# EAGLE design signalamp (EAGLE 9.6.2)
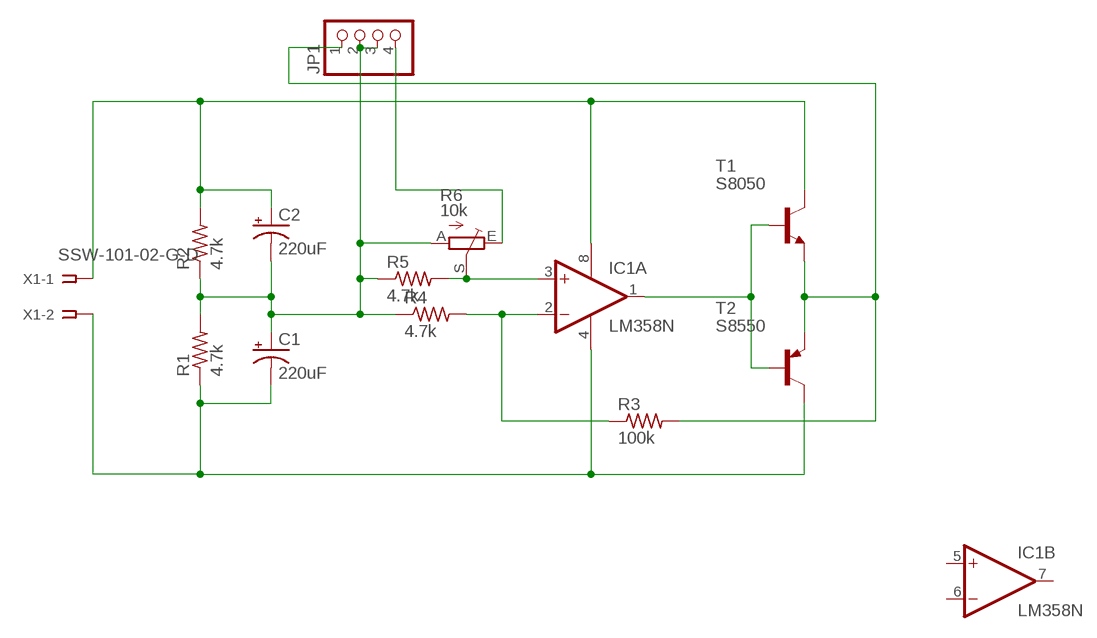
[diagram p0: schematic, sheet 1]

## Parts
C1  220uF  CPOL-USE2-5  [E2-5]
C2  220uF  CPOL-USE2-5  [E2-5]
IC1  LM358N  [DIL08]
JP1  PINHD-1X4  [1X04]
R1  4.7k  R-US_0204/7  [0204/7]
R2  4.7k  R-US_0204/7  [0204/7]
R3  100k  R-US_0207/5V  [0207/5V]
R4  4.7k  R-US_0204/7  [0204/7]
R5  4.7k  R-US_0207/2V  [0207/2V]
R6  10k  TRIM_EU-S64W  [S64W]
T1  S8050  -NPN-TO92-EBC  [TO92-EBC]
T2  S8550  BC558B-PNP-TO92-EBC  [TO92-EBC]
X1  SSW-101-02-G-D  [SSW-101-02-G-D]

## Nets
N$1: C2.+ IC1.8(P:V+) R2.2 T1.C X1.1
N$2: C1.- IC1.4(P:V-) R1.1 T2.C X1.2
N$3: IC1.3(A:+IN) R5.2 R6.S
N$4: C1.+ C2.- JP1.2 JP1.3 R1.2 R2.1 R4.1 R5.1 R6.A
N$5: JP1.1 R3.2 T1.E T2.E
N$6: IC1.1(A:OUT) T1.B T2.B
N$7: IC1.2(A:-IN) R3.1 R4.2
N$8: JP1.4 R6.E
Unconnected: IC1.5(B:+IN) IC1.6(B:-IN) IC1.7(B:OUT)

## Library data of the parts
C1 C2 = rcl:CPOL-US: POLARIZED CAPACITOR, American symbol; SPICEPREFIX: C
IC1 = linear:LM358: OP AMP also LM158; LM258; LM2904 Source: http://cache.national.com/ds/LM/LM158.pdf; SPICEPREFIX: B
JP1 = pinhead:PINHD-1X4: PIN HEADER
R1-R5 = rcl:R-US_: RESISTOR, American symbol; SPICEPREFIX: R
R6 = pot:TRIM_EU-: POTENTIOMETER
T1 = transistor:*-NPN-: NPN Transistror BF959 corrected 2008.03.06; SPICEPREFIX: J
T2 = transistor:*-PNP-: PNP Transistror
X1 = con-samtec:SSW-101-02-G: THROUGH-HOLE .025" SQ POST SOCKET Source: Samtec SSW.pdf; MF: Samtec Inc.; MPN: SSW-101-02-G-D; OC_FARNELL: unknown; OC_NEWARK: 82P1456; SPICEPREFIX: X

## Board
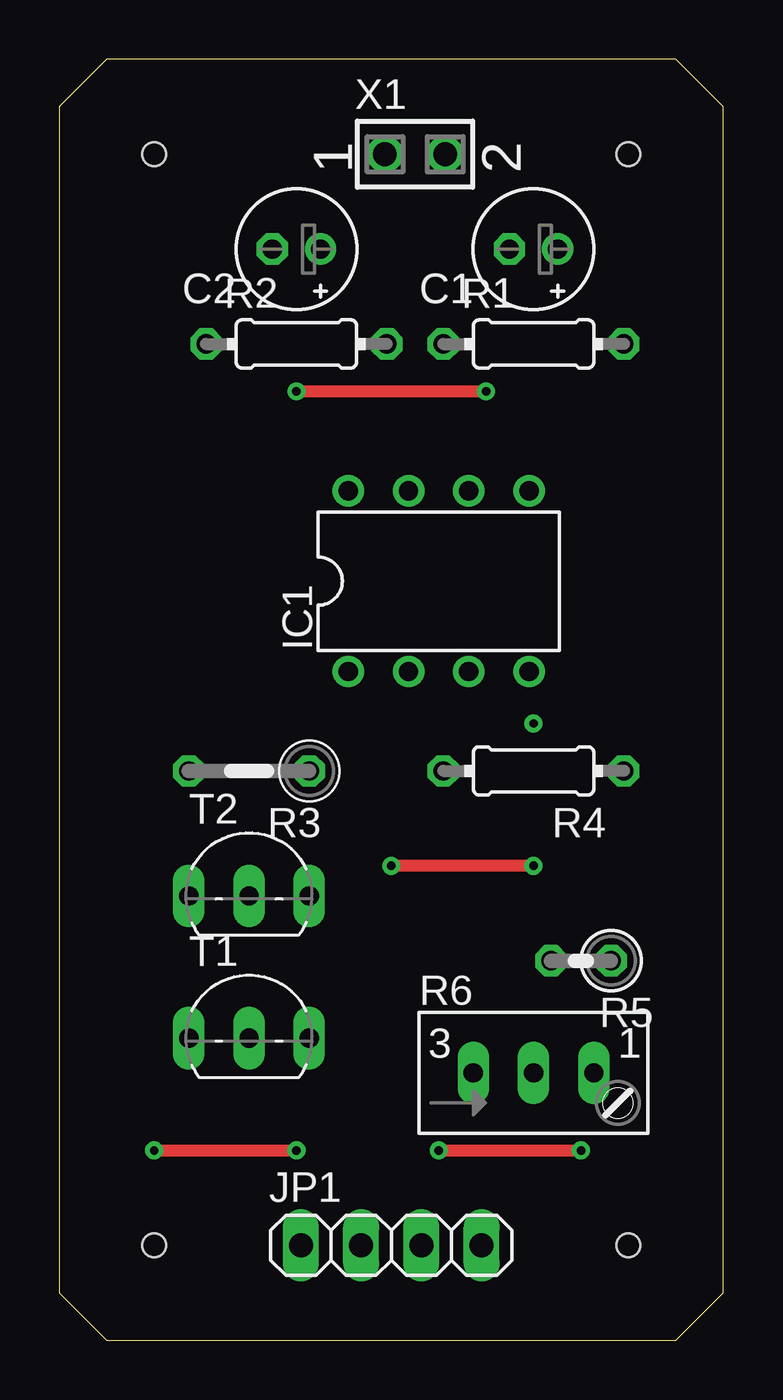
[diagram p1: board, top side]
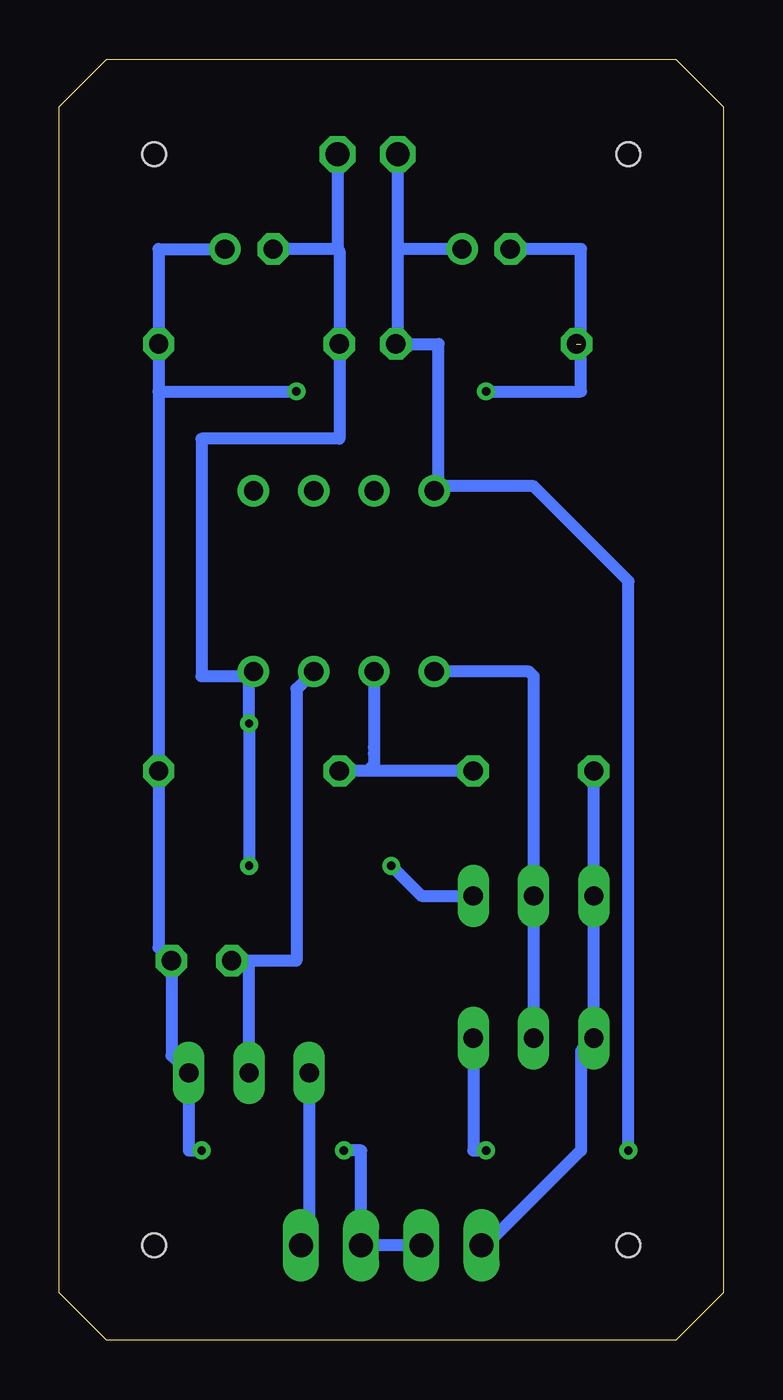
[diagram p2: board, bottom side, seen from below]

Size 28 x 54 mm. Coordinates in mm from the lower left corner, seen from the top.
Outline: 0,52 0,2 2,0 26,0 28,2 28,52 26,54 2,54 0,52
Copper layers (1*16): Top 0.035mm / dielectric 1.5mm / Bottom 0.035mm
Design rules "default": minimum track width 6mil, minimum drill 0.35mm, track to track 6mil, track to pad 6mil, pad to pad 6mil, via to via 6mil, smd to smd 6mil, copper to edge 40mil, drill to drill 6mil, minimum pad ring 10mil, minimum via ring 8mil, stop-mask expansion 4mil, vias tented up to drill 0mil, thermal gap 10mil
Holes 1 mm at 4,50 24,50 4,4 24,4

### Footprints (pad centres in the part's own frame; a part is rotated, then mirrored left to right if it is on the bottom)
E2-5 = drill 0.813 pad 1.27: + -1.016,0 | drill 0.813 pad 1.27 octagon: - 1.016,0
DIL08 = drill 0.813 pad 1.27: 1 -3.81,-3.81; 2 -1.27,-3.81; 3 1.27,-3.81; 4 3.81,-3.81; 5 3.81,3.81; 6 1.27,3.81; 7 -1.27,3.81; 8 -3.81,3.81
1X04 = drill 1.016 long: 1 -3.81,0; 2 -1.27,0; 3 1.27,0; 4 3.81,0
0204/7 = drill 0.813 octagon: 1 -3.81,0; 2 3.81,0
0207/5V = drill 0.813 octagon: 1 -2.54,0; 2 2.54,0
0207/2V = drill 0.813 octagon: 1 -1.27,0; 2 1.27,0
S64W = drill 0.813 long: A 2.54,1.27; E -2.54,1.27; S 0,1.27
TO92-EBC = drill 0.813 long: B 0,-1.27; C 2.54,-1.27; E -2.54,-1.27
SSW-101-02-G-D = drill 1 pad 1.5 octagon: 1 0,-1.27; 2 0,1.27

### Placement (x,y rotation side)
C1  20,46 180 top
C2  10,46 180 top
IC1  16,32 0 top
JP1  14,4 0 top
R1  20,42 0 top
R2  10,42 0 top
R3  8,24 180 top
R4  20,24 180 top
R5  22,16 180 top
R6  20,10 0 top
T1  8,14 0 top
T2  8,20 0 top
X1  15,50 270 top

### Tracks (layer width: path | path; a pad name or v marks a point on that pad's centre or on a via)
N$1  (via drill 0.35)
  Top 0.508: v4,8 v10,8
  Bottom 0.508: 12,36 12,42 R2.2 13.73,42.08 13.73,46 | v4,8 4,32 8,36 12,36 | 12,36 IC1.8 | C2.+ 13.73,46 | T1.C 10.54,8 v10,8 | X1.1 13.73,46
N$2  (via drill 0.35)
  Top 0.508: v20,20 v14,20
  Bottom 0.508: 20,28 22,28 22,38 16.19,38 R1.1 16.19,45.92 16.27,46 | 20,28 IC1.4 20,28.19 | 20,28 v20,26 v20,20 | X1.2 16.27,46 | 16.27,46 C1.- | v14,20 12.73,18.73 T2.C
N$3
  Bottom 0.508: IC1.3 18,27.46 18,16 20,16 | 20,16 R5.2 | R6.S 20,16
N$4  (via drill 0.35)  (1 unrouted)
  Top 0.508: v18,40 v10,40 | v16,8 v22,8
  Bottom 0.508: 23.81,40 R1.2 23.81,46 C1.+ | 23.81,40 R4.1 23.81,16.54 R5.1 23.27,12 R6.A 22.54,8 v22,8 | C2.- 6,46 6,42 | R2.1 6,41.81 6,40 v10,40 | 23.81,40 v18,40 | JP1.2 JP1.3 | 15,4 JP1.3 | JP1.3 15.27,8 v16,8
N$5
  Bottom 0.508: R3.2 T2.E T1.E 6,12.19 6,8 10,4 JP1.1
N$6
  Bottom 0.508: IC1.1 8.19,28.19 8,28 T2.B T1.B
N$7
  Bottom 0.508: R3.1 15,24 | 15,24 R4.2 | IC1.2 14.73,25 14.73,24.73 14.73,24.27 15,24
N$8
  Bottom 0.508: R6.E 17.46,4 JP1.4